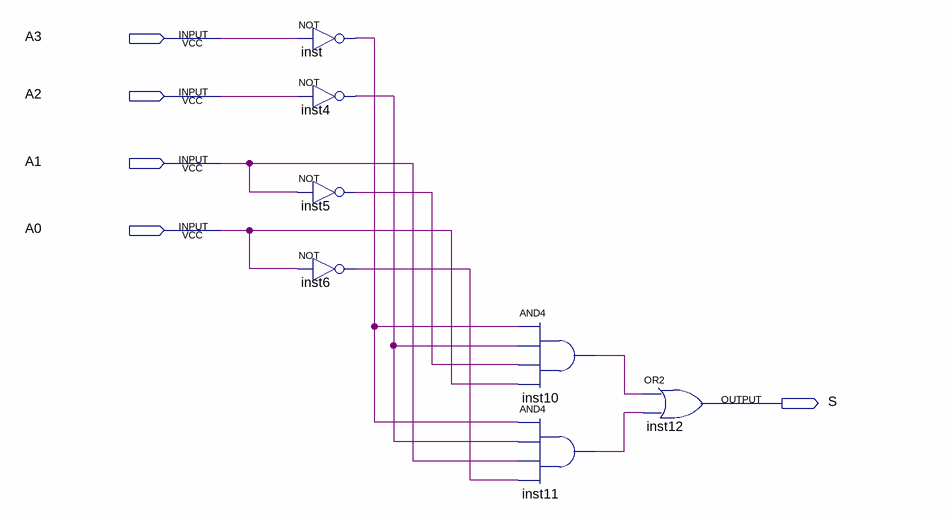
[diagram p0: schematic sheet]
// Quartus schematic DNI.bdf as structural Verilog: 7 symbols, 5 pins
module DNI (
  input  A3,
  input  A2,
  input  A1,
  input  A0,
  output S
);

  wire inst4_out, inst5_out, inst6_out, inst10_out, inst11_out, inst_out;

  not inst (inst_out, A3);
  not inst4 (inst4_out, A2);
  not inst5 (inst5_out, A1);
  not inst6 (inst6_out, A0);
  and inst10 (inst10_out, inst_out, inst4_out, inst5_out, A0);
  and inst11 (inst11_out, inst_out, inst4_out, A1, inst6_out);
  or inst12 (S, inst10_out, inst11_out);
endmodule
